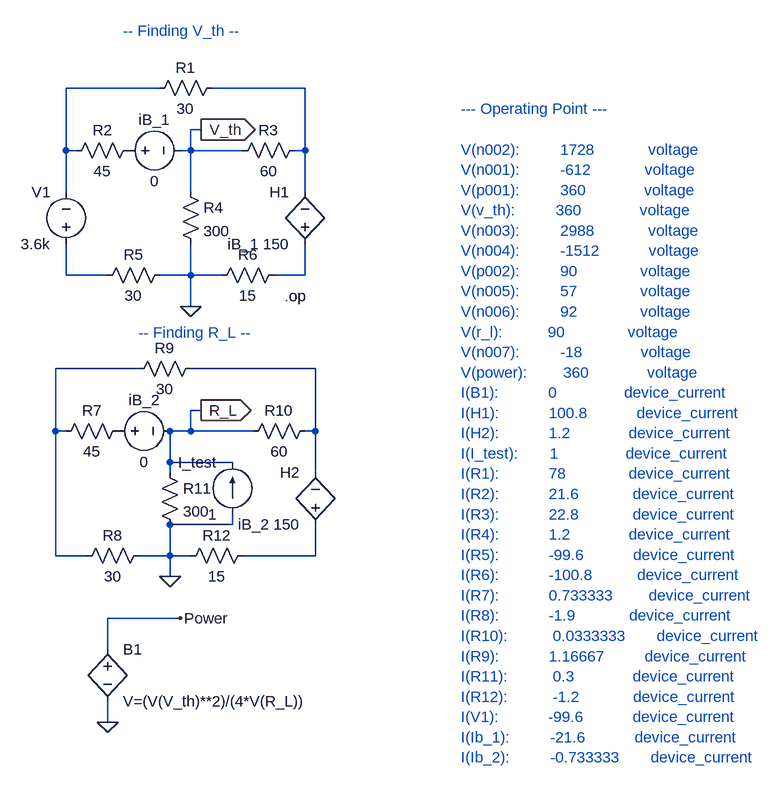
[diagram p0: schematic Q3.asc]
Q3.asc, the LTspice schematic file:
Version 4
SHEET 1 1804 1060
WIRE 112 64 -32 64
WIRE 336 64 192 64
WIRE 176 128 160 128
WIRE -32 160 -32 64
WIRE -16 160 -32 160
WIRE 160 160 160 128
WIRE 160 160 144 160
WIRE 240 160 160 160
WIRE 336 160 336 64
WIRE 336 160 320 160
WIRE -32 224 -32 160
WIRE 160 224 160 160
WIRE 336 224 336 160
WIRE -32 352 -32 304
WIRE 32 352 -32 352
WIRE 160 352 160 304
WIRE 160 352 112 352
WIRE 208 352 160 352
WIRE 336 352 336 304
WIRE 336 352 288 352
WIRE 160 400 160 352
WIRE 80 496 -48 496
WIRE 352 496 160 496
WIRE 176 560 160 560
WIRE -48 592 -48 496
WIRE -32 592 -48 592
WIRE 160 592 160 560
WIRE 160 592 128 592
WIRE 256 592 160 592
WIRE 352 592 352 496
WIRE 352 592 336 592
WIRE 128 640 128 592
WIRE 224 640 128 640
WIRE 128 656 128 640
WIRE 352 656 352 592
WIRE 224 736 224 720
WIRE 224 736 128 736
WIRE -48 784 -48 592
WIRE 0 784 -48 784
WIRE 128 784 128 736
WIRE 128 784 80 784
WIRE 160 784 128 784
WIRE 352 784 352 736
WIRE 352 784 240 784
WIRE 128 816 128 784
WIRE 144 880 32 880
WIRE 32 928 32 880
WIRE 32 1040 32 1008
FLAG 160 400 0
FLAG 176 128 V_th
IOPIN 176 128 Out
FLAG 128 816 0
FLAG 176 560 R_L
IOPIN 176 560 Out
FLAG 144 880 Power
FLAG 32 1040 0
SYMBOL res 208 48 R90
WINDOW 0 0 56 VBottom 2
WINDOW 3 32 56 VTop 2
SYMATTR InstName R1
SYMATTR Value 30
SYMBOL res 80 144 R90
WINDOW 0 0 56 VBottom 2
WINDOW 3 32 56 VTop 2
SYMATTR InstName R2
SYMATTR Value 45
SYMBOL res 336 144 R90
WINDOW 0 0 56 VBottom 2
WINDOW 3 32 56 VTop 2
SYMATTR InstName R3
SYMATTR Value 60
SYMBOL voltage -32 320 R180
WINDOW 0 24 96 Left 2
WINDOW 3 24 16 Left 2
SYMATTR InstName V1
SYMATTR Value 3.6k
SYMBOL res 144 208 R0
SYMATTR InstName R4
SYMATTR Value 300
SYMBOL res 128 336 R90
WINDOW 0 0 56 VBottom 2
WINDOW 3 32 56 VTop 2
SYMATTR InstName R5
SYMATTR Value 30
SYMBOL res 304 336 R90
WINDOW 0 0 56 VBottom 2
WINDOW 3 32 56 VTop 2
SYMATTR InstName R6
SYMATTR Value 15
SYMBOL h 336 320 R180
WINDOW 0 24 96 Left 2
WINDOW 3 24 16 Left 2
SYMATTR InstName H1
SYMATTR Value iB_1 150
SYMBOL voltage 48 160 R270
WINDOW 0 32 56 VTop 2
WINDOW 3 -32 56 VBottom 2
SYMATTR InstName iB_1
SYMATTR Value 0
SYMBOL res 64 576 R90
WINDOW 0 0 56 VBottom 2
WINDOW 3 32 56 VTop 2
SYMATTR InstName R7
SYMATTR Value 45
SYMBOL res 96 768 R90
WINDOW 0 0 56 VBottom 2
WINDOW 3 32 56 VTop 2
SYMATTR InstName R8
SYMATTR Value 30
SYMBOL res 352 576 R90
WINDOW 0 0 56 VBottom 2
WINDOW 3 32 56 VTop 2
SYMATTR InstName R10
SYMATTR Value 60
SYMBOL res 176 480 R90
WINDOW 0 0 56 VBottom 2
WINDOW 3 32 56 VTop 2
SYMATTR InstName R9
SYMATTR Value 30
SYMBOL res 112 640 R0
SYMATTR InstName R11
SYMATTR Value 300
SYMBOL res 256 768 R90
WINDOW 0 0 56 VBottom 2
WINDOW 3 32 56 VTop 2
SYMATTR InstName R12
SYMATTR Value 15
SYMBOL h 352 752 R180
WINDOW 0 24 96 Left 2
WINDOW 3 24 16 Left 2
SYMATTR InstName H2
SYMATTR Value iB_2 150
SYMBOL voltage 32 592 R270
WINDOW 0 32 56 VTop 2
WINDOW 3 -32 56 VBottom 2
SYMATTR InstName iB_2
SYMATTR Value 0
SYMBOL current 224 720 R180
WINDOW 0 24 80 Left 2
WINDOW 3 24 0 Left 2
SYMATTR InstName I_test
SYMATTR Value 1
SYMBOL bv 32 912 R0
SYMATTR InstName B1
SYMATTR Value V=(V(V_th)**2)/(4*V(R_L))
TEXT 304 384 Left 2 !.op
TEXT 56 -24 Left 2 ;-- Finding V_th --
TEXT 80 440 Left 2 ;-- Finding R_L --
TEXT 576 96 Left 2 ;--- Operating Point ---\n \nV(n002):         1728            voltage\nV(n001):         -612            voltage\nV(p001):         360             voltage\nV(v_th):         360             voltage\nV(n003):         2988            voltage\nV(n004):         -1512           voltage\nV(p002):         90              voltage\nV(n005):         57              voltage\nV(n006):         92              voltage\nV(r_l):          90              voltage\nV(n007):         -18             voltage\nV(power):        360             voltage\nI(B1):           0               device_current\nI(H1):           100.8           device_current\nI(H2):           1.2             device_current\nI(I_test):       1               device_current\nI(R1):           78              device_current\nI(R2):           21.6            device_current\nI(R3):           22.8            device_current\nI(R4):           1.2             device_current\nI(R5):           -99.6           device_current\nI(R6):           -100.8          device_current\nI(R7):           0.733333        device_current\nI(R8):           -1.9            device_current\nI(R10):          0.0333333       device_current\nI(R9):           1.16667         device_current\nI(R11):          0.3             device_current\nI(R12):          -1.2            device_current\nI(V1):           -99.6           device_current\nI(Ib_1):         -21.6           device_current\nI(Ib_2):         -0.733333       device_current

The netlist it stands for:
* Q3.asc
R1 N002 N001 30
R2 P001 N001 45
R3 N002 V_th 60
V1 N003 N001 3.6k
R4 V_th 0 300
R5 0 N003 30
R6 N004 0 15
H1 N004 N002 iB_1 150
V§iB_1 P001 V_th 0
R7 P002 N005 45
R8 0 N005 30
R10 N006 R_L 60
R9 N006 N005 30
R11 R_L 0 300
R12 N007 0 15
H2 N007 N006 iB_2 150
V§iB_2 P002 R_L 0
I_test 0 R_L 1
B1 Power 0 V=(V(V_th)**2)/(4*V(R_L))
.op
* -- Finding V_th --
* -- Finding R_L --
* --- Operating Point ---
* V(n002):         1728            voltage
* V(n001):         -612            voltage
* V(p001):         360             voltage
* V(v_th):         360             voltage
* V(n003):         2988            voltage
* V(n004):         -1512           voltage
* V(p002):         90              voltage
* V(n005):         57              voltage
* V(n006):         92              voltage
* V(r_l):          90              voltage
* V(n007):         -18             voltage
* V(power):        360             voltage
* I(B1):           0               device_current
* I(H1):           100.8           device_current
* I(H2):           1.2             device_current
* I(I_test):       1               device_current
* I(R1):           78              device_current
* I(R2):           21.6            device_current
* I(R3):           22.8            device_current
* I(R4):           1.2             device_current
* I(R5):           -99.6           device_current
* I(R6):           -100.8          device_current
* I(R7):           0.733333        device_current
* I(R8):           -1.9            device_current
* I(R10):          0.0333333       device_current
* I(R9):           1.16667         device_current
* I(R11):          0.3             device_current
* I(R12):          -1.2            device_current
* I(V1):           -99.6           device_current
* I(Ib_1):         -21.6           device_current
* I(Ib_2):         -0.733333       device_current
.backanno
.end